# Altium project Scanner_Board.PrjPcb
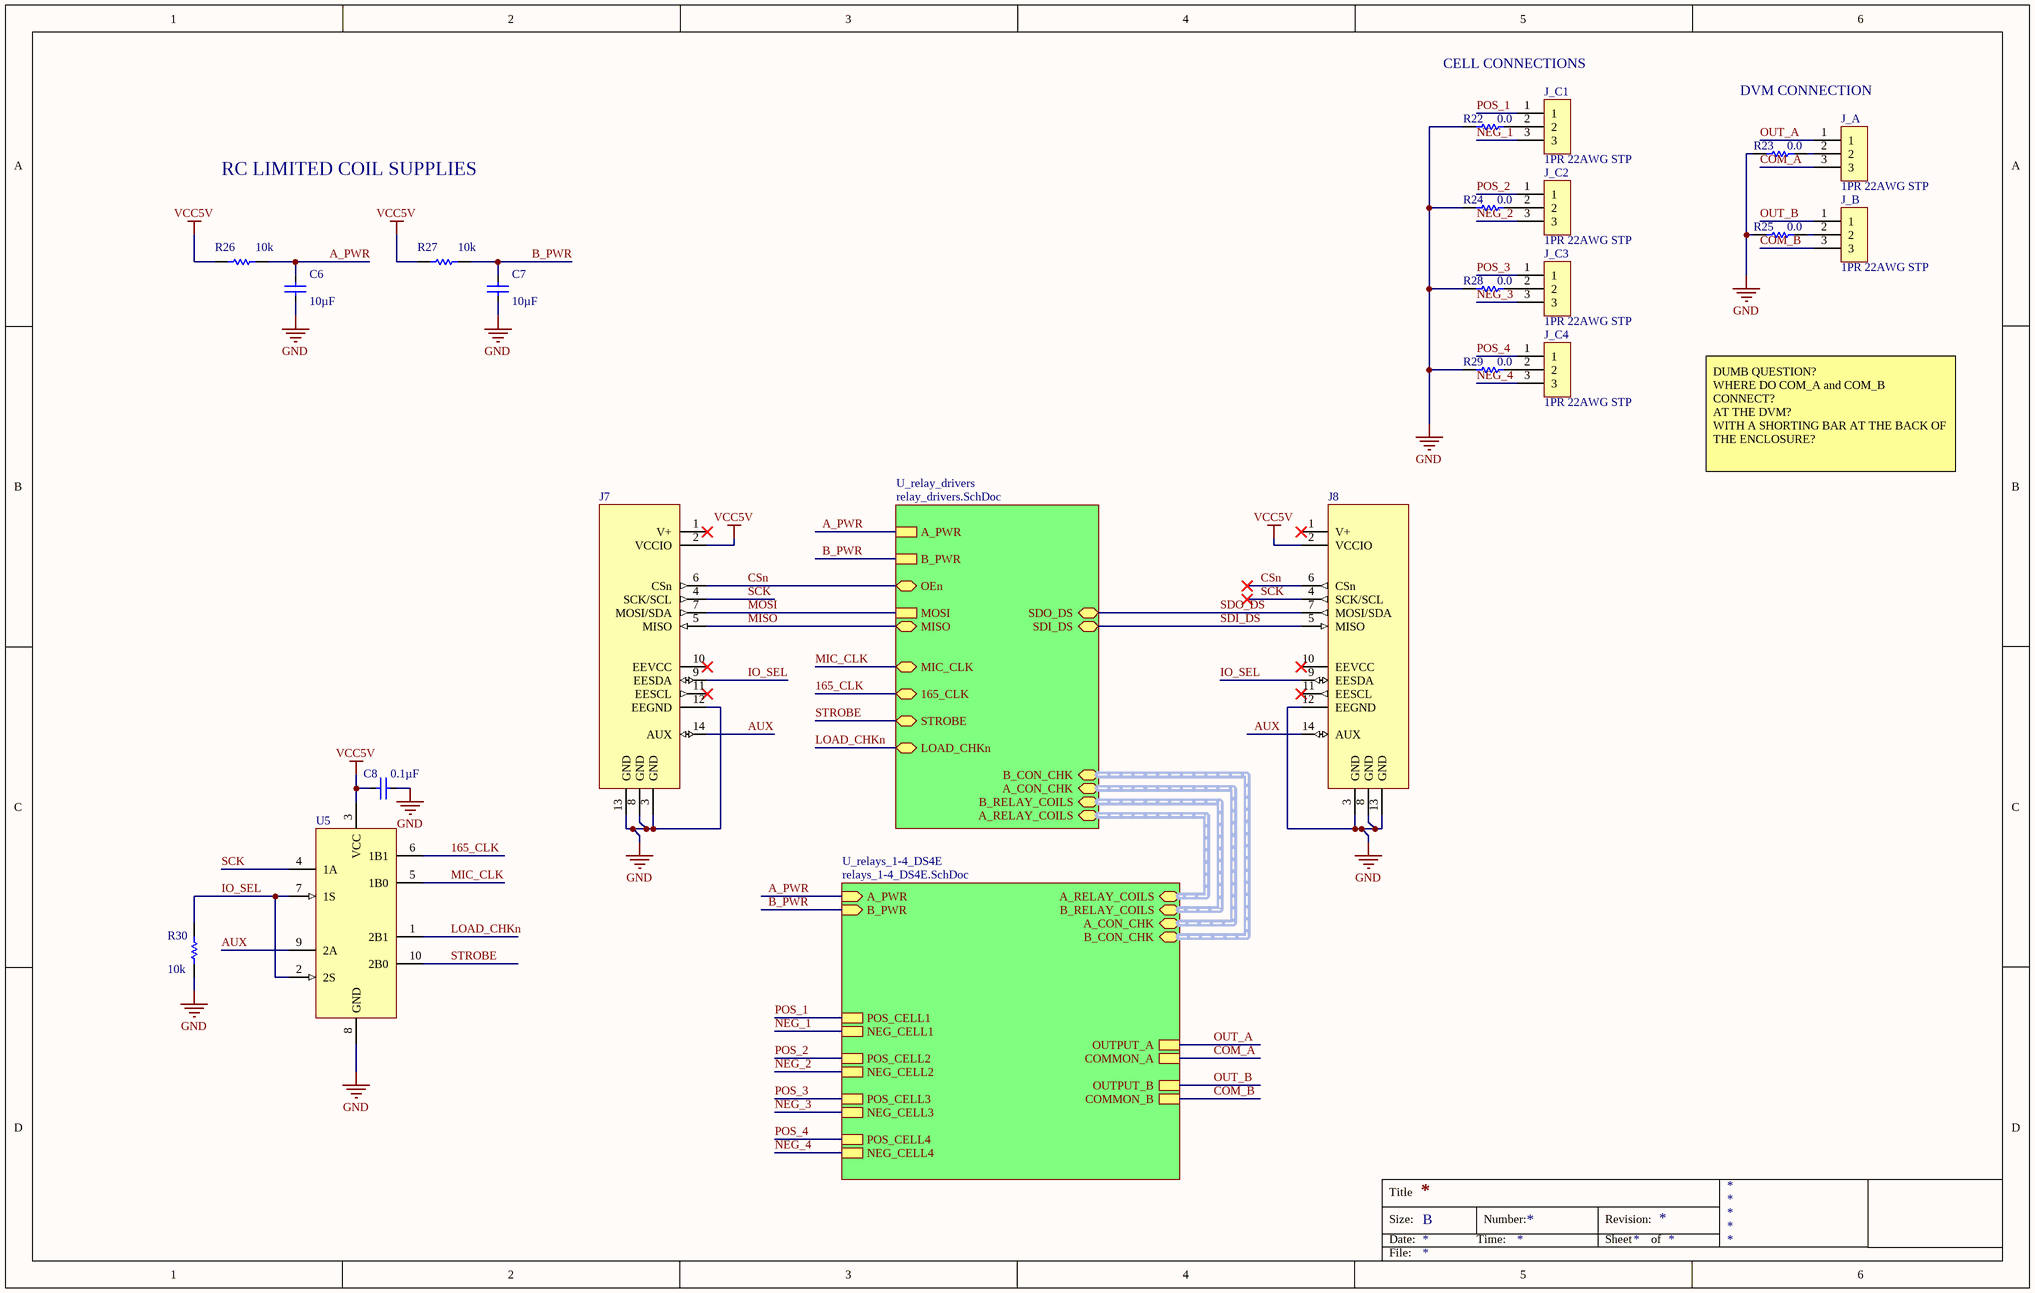
[diagram p0: scanner_board_TOP.SchDoc]
3 sheets, 74 parts. Net scope: hierarchical (ports join the sheet entries above them; power ports are global).
Board file: 4CH_Scanner_Board.PcbDoc
Sheets:
  scanner_board_TOP.SchDoc
    U_relays_1-4_DS4E = relays_1-4_DS4E.SchDoc
    U_relay_drivers = relay_drivers.SchDoc

## Sheet scanner_board_TOP.SchDoc
size B

### Parts
C6  10µF  [CAPC3216X160L55N]
C7  10µF  [CAPC3216X160L55N]
C8  0.1µF  [CAPC1005X55L25N]
J7  QUIKEVAL_HEADER  [0878311420]  (value not drawn)
J8  QUIKEVAL_HEADER  [0878311420]  (value not drawn)
J_A  1PR 22AWG STP  [HDRV3W25P100_3X1_300X100H500]
J_B  1PR 22AWG STP  [HDRV3W25P100_3X1_300X100H500]
J_C1  1PR 22AWG STP  [HDRV3W25P100_3X1_300X100H500]
J_C2  1PR 22AWG STP  [HDRV3W25P100_3X1_300X100H500]
J_C3  1PR 22AWG STP  [HDRV3W25P100_3X1_300X100H500]
J_C4  1PR 22AWG STP  [HDRV3W25P100_3X1_300X100H500]
R22  0.0  [RESC2012X75L55N]
R23  0.0  [RESC2012X75L55N]
R24  0.0  [RESC2012X75L55N]
R25  0.0  [RESC2012X75L55N]
R26  10k  [RESC_3216[1206]_N]
R27  10k  [RESC_3216[1206]_N]
R28  0.0  [RESC2012X75L55N]
R29  0.0  [RESC2012X75L55N]
R30  10k  [RESC2012X75L55N]
U5  FSA2257MUX  [SOP50P490X110-10L30N]  (value not drawn)

### Sub-sheets
U_relay_drivers = relay_drivers.SchDoc: A_PWR, B_PWR, MOSI, A_RELAY_COILS (harness 4CELL_CON_REL), B_RELAY_COILS (harness 4CELL_CON_REL), SDO_DS, MIC_CLK, A_CON_CHK (harness 4CELL_CON_CHK), B_CON_CHK (harness 4CELL_CON_CHK), MISO, STROBE, LOAD_CHKn, 165_CLK, SDI_DS, OEn
U_relays_1-4_DS4E = relays_1-4_DS4E.SchDoc: POS_CELL1, A_PWR (in), NEG_CELL1, B_PWR (in), POS_CELL2, NEG_CELL2, OUTPUT_A, COMMON_A, OUTPUT_B, COMMON_B, POS_CELL3, NEG_CELL3, POS_CELL4, NEG_CELL4, A_RELAY_COILS (harness 4CELL_CON_REL), B_RELAY_COILS (harness 4CELL_CON_REL), A_CON_CHK (harness 4CELL_CON_CHK), B_CON_CHK (harness 4CELL_CON_CHK)

### Nets
GND: C6.2 C7.2 C8.2 J7.3(GND) J7.8(GND) J7.12(EEGND) J7.13(GND) J8.3(GND) J8.8(GND) J8.12(EEGND) J8.13(GND) R22.2 R23.2 R24.2 R25.2 R28.2 R29.2 R30.1 U5.8(GND)
VCC5V: C8.1 J7.2(VCCIO) J8.2(VCCIO) R26.1 R27.1 U5.3(VCC)
165_CLK: U5.6(1B1) ; sheet U_relay_drivers/165_CLK
A_PWR: C6.1 R26.2 ; sheet U_relays_1-4_DS4E/A_PWR, sheet U_relay_drivers/A_PWR
AUX: J7.14(AUX) J8.14(AUX) U5.9(2A)
B_PWR: C7.1 R27.2 ; sheet U_relays_1-4_DS4E/B_PWR, sheet U_relay_drivers/B_PWR
COM_A: J_A.3 ; sheet U_relays_1-4_DS4E/COMMON_A
COM_B: J_B.3 ; sheet U_relays_1-4_DS4E/COMMON_B
CSn: J7.6(CSn) J8.6(CSn) ; sheet U_relay_drivers/OEn
IO_SEL: J7.9(EESDA) J8.9(EESDA) R30.2 U5.2(2S) U5.7(1S)
LOAD_CHKn: U5.1(2B1) ; sheet U_relay_drivers/LOAD_CHKn
MIC_CLK: U5.5(1B0) ; sheet U_relay_drivers/MIC_CLK
MISO: J7.5(MISO) ; sheet U_relay_drivers/MISO
MOSI: J7.7(MOSI/SDA) ; sheet U_relay_drivers/MOSI
NEG_1: J_C1.3 ; sheet U_relays_1-4_DS4E/NEG_CELL1
NEG_2: J_C2.3 ; sheet U_relays_1-4_DS4E/NEG_CELL2
NEG_3: J_C3.3 ; sheet U_relays_1-4_DS4E/NEG_CELL3
NEG_4: J_C4.3 ; sheet U_relays_1-4_DS4E/NEG_CELL4
OUT_A: J_A.1 ; sheet U_relays_1-4_DS4E/OUTPUT_A
OUT_B: J_B.1 ; sheet U_relays_1-4_DS4E/OUTPUT_B
POS_1: J_C1.1 ; sheet U_relays_1-4_DS4E/POS_CELL1
POS_2: J_C2.1 ; sheet U_relays_1-4_DS4E/POS_CELL2
POS_3: J_C3.1 ; sheet U_relays_1-4_DS4E/POS_CELL3
POS_4: J_C4.1 ; sheet U_relays_1-4_DS4E/POS_CELL4
SCK: J7.4(SCK/SCL) J8.4(SCK/SCL) U5.4(1A)
SDI_DS: J8.5(MISO) ; sheet U_relay_drivers/SDI_DS
SDO_DS: J8.7(MOSI/SDA) ; sheet U_relay_drivers/SDO_DS
STROBE: U5.10(2B0) ; sheet U_relay_drivers/STROBE
NetJ_A_2: J_A.2 R23.1
NetJ_B_2: J_B.2 R25.1
NetJ_C1_2: J_C1.2 R22.1
NetJ_C2_2: J_C2.2 R24.1
NetJ_C3_2: J_C3.2 R28.1
NetJ_C4_2: J_C4.2 R29.1

Not connected (* = marked no-connect by the designer): J7 1(V+)* 10(EEVCC)* 11(EESCL)*; J8 1(V+)* 10(EEVCC)* 11(EESCL)*

### Buses and harness runs
harness sheet U_relay_drivers/A_CON_CHK = sheet U_relays_1-4_DS4E/A_CON_CHK
harness sheet U_relay_drivers/A_RELAY_COILS = sheet U_relays_1-4_DS4E/A_RELAY_COILS
harness sheet U_relay_drivers/B_CON_CHK = sheet U_relays_1-4_DS4E/B_CON_CHK
harness sheet U_relay_drivers/B_RELAY_COILS = sheet U_relays_1-4_DS4E/B_RELAY_COILS

### Notes on the sheet
- CELL CONNECTIONS
- DVM CONNECTION
- RC LIMITED COIL SUPPLIES
- DUMB QUESTION?
  WHERE DO COM_A and COM_B CONNECT?
  AT THE DVM?
  WITH A SHORTING BAR AT THE BACK OF THE ENCLOSURE?
- Title
- Size:
- Date:
- B
- Time:
- Number:
- Revision:
- Sheet
- of
- File:

### Library data of the parts
C6 C7 = GRM31CR71E106KA12L: CAP CER 10UF 25V X7R 1206; Manufacturer: Murata Electronics North America; Tolerance: ±10%; Design Item Id: GRM31CR71E106KA12L; Supplier 1: Digi-Key; Supplier Part Number 1: 490-6518-1-ND; Manufacturer Part Number: GRM31CR71E106KA12L; RoHS: RoHS Compliant; Category: Capacitors; Stock 1: 157542; Pricing 1: 1=0.83, 10=0.706, 50=0.5194, 100=0.4129, 250=0.34632, 500=0.31302, 1000=0.28638 (USD); Packaging: Cut Tape (CT); Applications: General Purpose; Operating Temperature: -55°C ~ 125°C; Mounting Type: Surface Mount, MLCC; Package / Case: 1206 (3216 Metric); ComponentLink1URL: http://www.murata.com/~/media/webrenewal/support/library/catalog/products/capacitor/mlcc/c02e.pdf; ComponentLink1Description: http://www.murata.com/~/media/webrenewal/support/library/catalog/products/capacitor/mlcc/c02e.pdf; Capacitance: 10µF; Voltage - Rated: 25V; Temperature Coefficient: X7R; Ratings: -; Size / Dimension: 0.126" L x 0.063" W (3.20mm x 1.60mm); Height - Seated (Max): -; Thickness (Max): 0.071" (1.80mm); Lead Spacing: -; Features: -; Lead Style: -
C8 = GRM155R71C104JA88D: CAP CER 0.1UF 16V X7R 0402; Manufacturer: Murata Electronics North America; Tolerance: ±5%; Design Item Id: GRM155R71C104JA88D; Supplier 1: Digi-Key; Supplier Part Number 1: 490-6327-1-ND; Manufacturer Part Number: GRM155R71C104JA88D; RoHS: RoHS Compliant; Category: Capacitors; Stock 1: 844721; Pricing 1: 1=0.1, 10=0.026, 50=0.0144, 100=0.0121, 250=0.00992, 500=0.00848, 1000=0.0066, 5000=0.0055 (USD); Packaging: Cut Tape (CT); Applications: General Purpose; Operating Temperature: -55°C ~ 125°C; Mounting Type: Surface Mount, MLCC; Package / Case: 0402 (1005 Metric); ComponentLink1URL: http://www.murata.com/~/media/webrenewal/support/library/catalog/products/capacitor/mlcc/c02e.pdf; ComponentLink1Description: http://www.murata.com/~/media/webrenewal/support/library/catalog/products/capacitor/mlcc/c02e.pdf; Capacitance: 0.1µF; Voltage - Rated: 16V; Temperature Coefficient: X7R; Ratings: -; Size / Dimension: 0.039" L x 0.020" W (1.00mm x 0.50mm); Height - Seated (Max): -; Thickness (Max): 0.022" (0.55mm); Lead Spacing: -; Features: -; Lead Style: *
J7 J8 = 0878311420: CONN HEADER 14POS 2MM VERT GOLD; Manufacturer: Molex, LLC; Design Item Id: 0878311420; Supplier 1: Digi-Key; Supplier Part Number 1: WM17469-ND; Manufacturer Part Number: 0878311420; RoHS: RoHS Compliant; Category: Connectors, Interconnects; Stock 1: 20079; Pricing 1: 1=1.37, 10=1.239, 100=1.062, 500=0.88498, 1000=0.75855, 5000=0.67258, 10000=0.65741 (USD); Packaging: Tube
J_A J_B J_C1-J_C4 = CON-STP-22AWG-x3: SOLDER HOLES FOR 3 22AWG WIRES; Design Item Id: CON-STP-22AWG-x3
R22-R25 R28 R29 = ERJ-6BWFR030V: RES SMD 0.03 OHM 1% 1/2W 0805; Manufacturer: Panasonic Electronic Components; Resistance: 0.03; Power (Watts): 0.5W, 1/2W; Temperature Coefficient: ±200ppm/°C; Design Item Id: ERJ-6BWFR030V; Footprint: RESC_2012[0805]_N; Supplier 1: Digi-Key; Supplier Part Number 1: P.03AQCT-ND; Manufacturer Part Number: ERJ-6BWFR030V; RoHS: RoHS Compliant; Category: Resistors; Stock 1: 75764; Pricing 1: 1=0.66, 50=0.3466, 100=0.2859, 250=0.24832, 500=0.20212, 1000=0.16031 (USD); Packaging: Cut Tape (CT); Operating Temperature: -55°C ~ 155°C; Package / Case: 0805 (2012 Metric); Supplier Device Package: 0805; ComponentLink1URL: http://industrial.panasonic.com/lecs/www-data/pdf/AOA0000/AOA0000CE3.pdf; ComponentLink1Description: http://industrial.panasonic.com/lecs/www-data/pdf/AOA0000/AOA0000CE3.pdf; Tolerance: ±1%; Composition: Thick Film; Features: Automotive AEC-Q200, Current Sense; Size / Dimension: 0.079" L x 0.049" W (2.00mm x 1.25mm); Height: 0.028" (0.70mm); Number of Terminations: 2
R26 R27 = CRCW120610K0JNEA: RES SMD 10K OHM 5% 1/4W 1206; Manufacturer: Vishay Dale; Power (Watts): 0.25W, 1/4W; Temperature Coefficient: ±200ppm/°C; Resistance: 10k; Design Item Id: CRCW120610K0JNEA; Supplier 1: Digi-Key; Supplier Part Number 1: 541-10KECT-ND; Manufacturer Part Number: CRCW120610K0JNEA; RoHS: RoHS Compliant; Category: Resistors; Stock 1: 299066; Pricing 1: 10=0.04, 50=0.0214, 200=0.01235, 1000=0.00841 (USD); Packaging: Cut Tape (CT); Operating Temperature: -55°C ~ 155°C; Package / Case: 1206 (3216 Metric); Supplier Device Package: 1206 (3216 Metric); ComponentLink1URL: http://www.vishay.com/docs/20035/dcrcwe3.pdf; ComponentLink1Description: http://www.vishay.com/docs/20035/dcrcwe3.pdf; Tolerance: ±5%; Composition: Thick Film; Features: Automotive AEC-Q200; Size / Dimension: 0.126" L x 0.063" W (3.20mm x 1.60mm); Height: 0.024" (0.60mm); Number of Terminations: 2
R30 = ERJ-P06J103V: RES SMD 10K OHM 5% 1/2W 0805; Manufacturer: Panasonic Electronic Components; Power (Watts): 0.5W, 1/2W; Temperature Coefficient: ±200ppm/°C; Resistance: 10k; Design Item Id: ERJ-P06J103V; Supplier 1: Digi-Key; Supplier Part Number 1: P10KADCT-ND; Manufacturer Part Number: ERJ-P06J103V; RoHS: RoHS Compliant; Category: Resistors; Stock 1: 181490; Pricing 1: 1=0.12, 10=0.112, 100=0.0429, 1000=0.01889, 2500=0.01632 (USD); Packaging: Cut Tape (CT); Operating Temperature: -55°C ~ 155°C; Package / Case: 0805 (2012 Metric); Supplier Device Package: 0805; ComponentLink1URL: https://industrial.panasonic.com/cdbs/www-data/pdf/RDO0000/AOA0000C331.pdf; ComponentLink1Description: https://industrial.panasonic.com/cdbs/www-data/pdf/RDO0000/AOA0000C331.pdf; Tolerance: ±5%; Composition: Thick Film; Features: Automotive AEC-Q200, Pulse Withstanding; Size / Dimension: 0.079" L x 0.049" W (2.00mm x 1.25mm); Part Status: Active; Height - Seated (Max): 0.028" (0.70mm); Failure Rate: -
U5 = FSA2257MUX: IC SWITCH DUAL SPDT 10MSOP; Manufacturer: Fairchild/ON Semiconductor; Multiplexer/Demultiplexer Circuit: 2:1; On-State Resistance (Max): 1.5 Ohm (Typ); Design Item Id: FSA2257MUX; Supplier 1: Digi-Key; Supplier Part Number 1: FSA2257MUXCT-ND; Manufacturer Part Number: FSA2257MUX; RoHS: RoHS Compliant; Category: Integrated Circuits (ICs); Stock 1: 2927; Pricing 1: 1=0.85, 10=0.748, 100=0.5733, 500=0.4532, 1000=0.36256 (USD); Packaging: Cut Tape (CT); ComponentLink1URL: https://www.fairchildsemi.com/datasheets/FS/FSA2257.pdf; ComponentLink1Description: https://www.fairchildsemi.com/datasheets/FS/FSA2257.pdf; Part Status: Active; Switch Circuit: SPDT

## Sheet relays_1-4_DS4E.SchDoc
size B
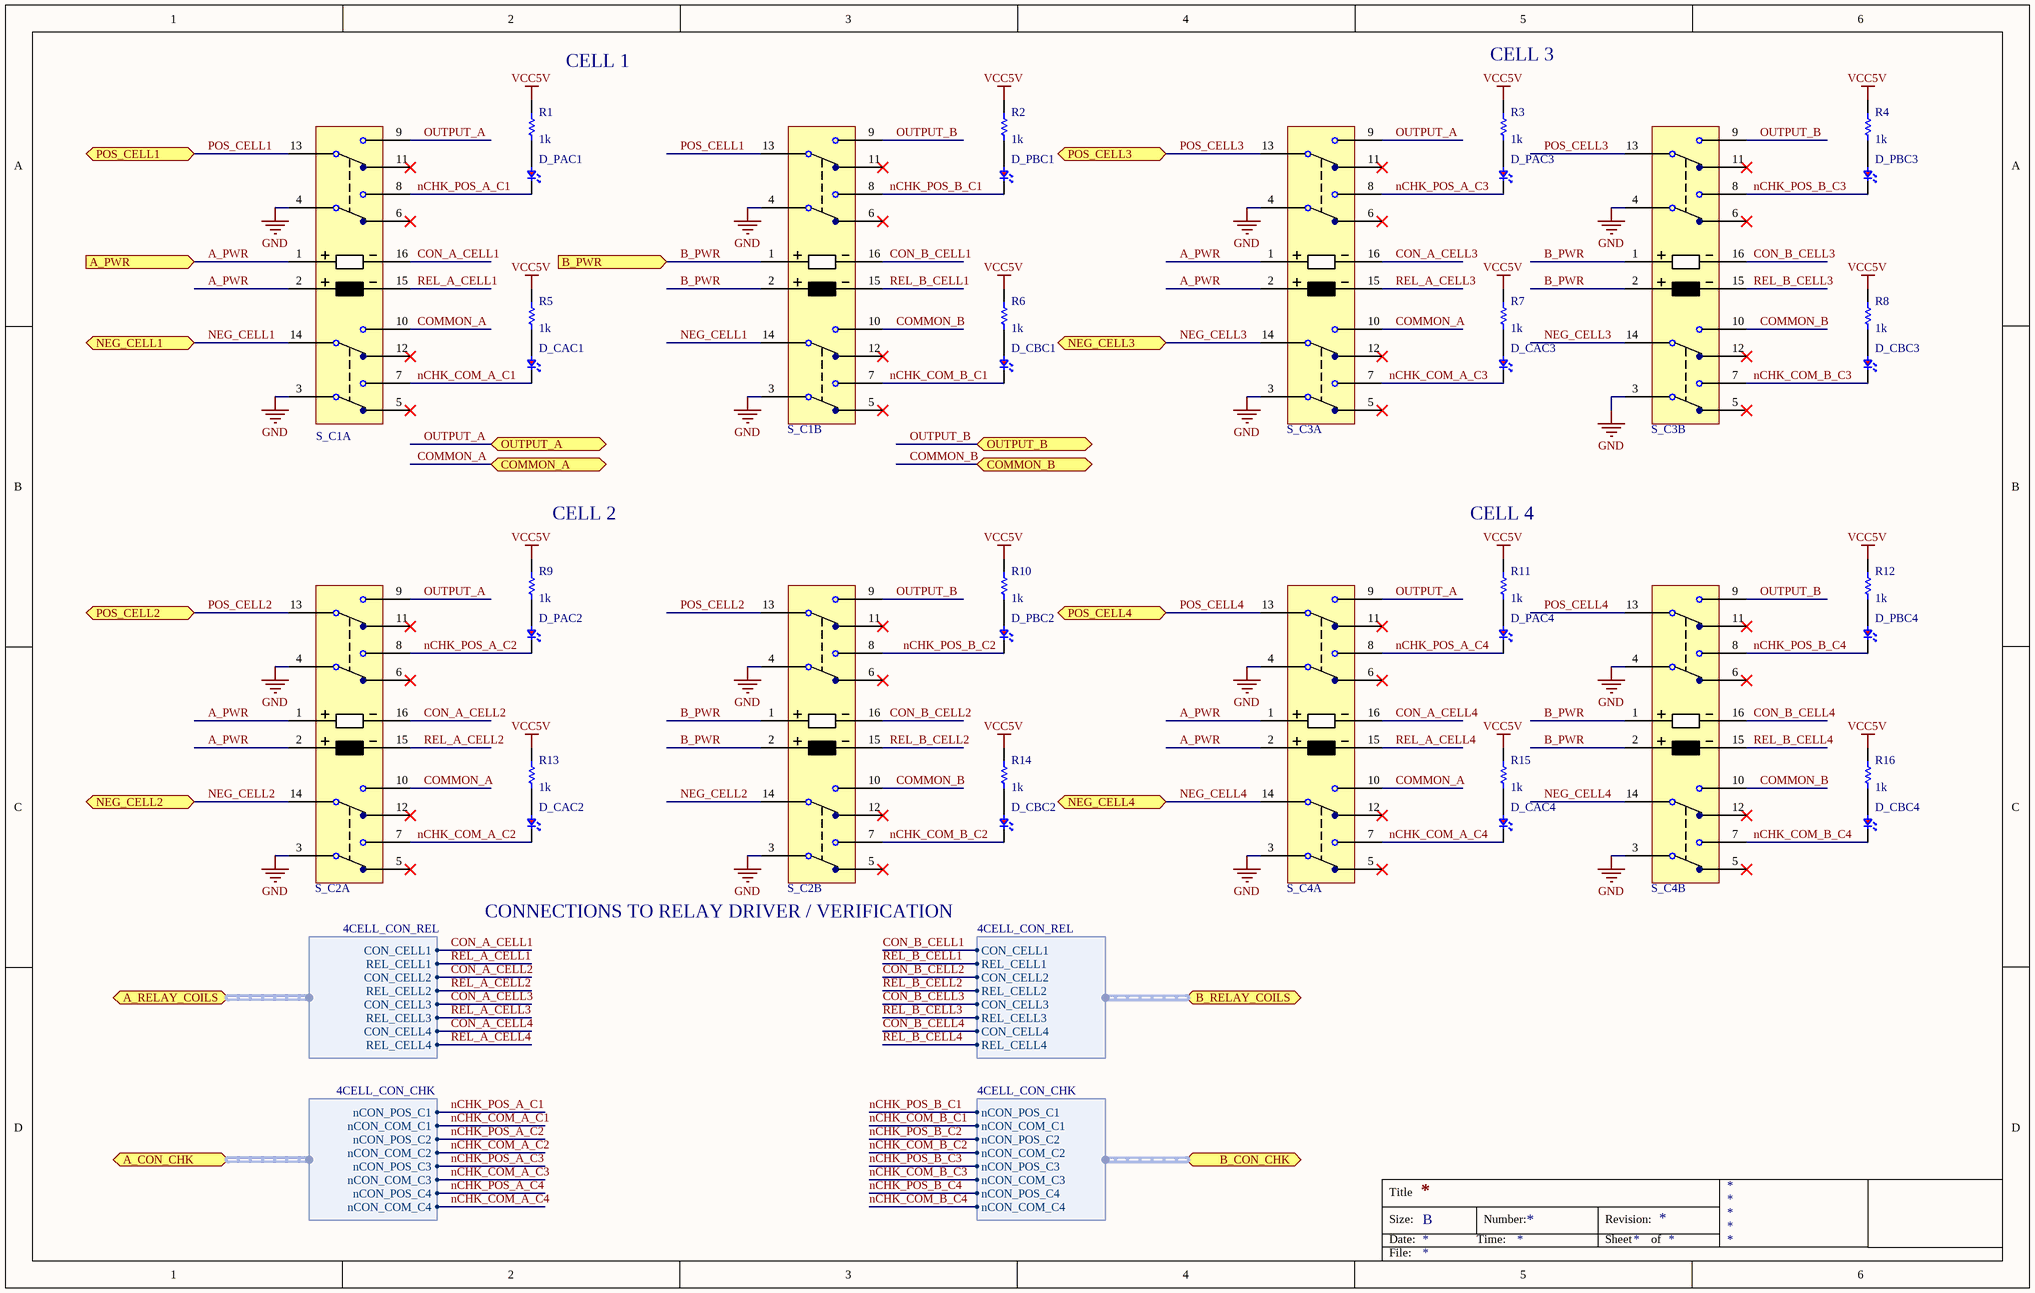
[diagram p1: relays_1-4_DS4E.SchDoc]

### Parts
D_CAC1  Red LED  [LEDRD100W25D118H196]  (value not drawn)
D_CAC2  Red LED  [LEDRD100W25D118H196]  (value not drawn)
D_CAC3  Red LED  [LEDRD100W25D118H196]  (value not drawn)
D_CAC4  Red LED  [LEDRD100W25D118H196]  (value not drawn)
D_CBC1  Red LED  [LEDRD100W25D118H196]  (value not drawn)
D_CBC2  Red LED  [LEDRD100W25D118H196]  (value not drawn)
D_CBC3  Red LED  [LEDRD100W25D118H196]  (value not drawn)
D_CBC4  Red LED  [LEDRD100W25D118H196]  (value not drawn)
D_PAC1  Red LED  [LEDRD100W25D118H196]  (value not drawn)
D_PAC2  Red LED  [LEDRD100W25D118H196]  (value not drawn)
D_PAC3  Red LED  [LEDRD100W25D118H196]  (value not drawn)
D_PAC4  Red LED  [LEDRD100W25D118H196]  (value not drawn)
D_PBC1  Red LED  [LEDRD100W25D118H196]  (value not drawn)
D_PBC2  Red LED  [LEDRD100W25D118H196]  (value not drawn)
D_PBC3  Red LED  [LEDRD100W25D118H196]  (value not drawn)
D_PBC4  Red LED  [LEDRD100W25D118H196]  (value not drawn)
R1  1k  [RESC2012X75L55N]
R2  1k  [RESC2012X75L55N]
R3  1k  [RESC2012X75L55N]
R4  1k  [RESC2012X75L55N]
R5  1k  [RESC2012X75L55N]
R6  1k  [RESC2012X75L55N]
R7  1k  [RESC2012X75L55N]
R8  1k  [RESC2012X75L55N]
R9  1k  [RESC2012X75L55N]
R10  1k  [RESC2012X75L55N]
R11  1k  [RESC2012X75L55N]
R12  1k  [RESC2012X75L55N]
R13  1k  [RESC2012X75L55N]
R14  1k  [RESC2012X75L55N]
R15  1k  [RESC2012X75L55N]
R16  1k  [RESC2012X75L55N]
S_C1A  4PDT_RELAY_L2  [L2_4PDT_RELAY]  (value not drawn)
S_C1B  4PDT_RELAY_L2  [L2_4PDT_RELAY]  (value not drawn)
S_C2A  4PDT_RELAY_L2  [L2_4PDT_RELAY]  (value not drawn)
S_C2B  4PDT_RELAY_L2  [L2_4PDT_RELAY]  (value not drawn)
S_C3A  4PDT_RELAY_L2  [L2_4PDT_RELAY]  (value not drawn)
S_C3B  4PDT_RELAY_L2  [L2_4PDT_RELAY]  (value not drawn)
S_C4A  4PDT_RELAY_L2  [L2_4PDT_RELAY]  (value not drawn)
S_C4B  4PDT_RELAY_L2  [L2_4PDT_RELAY]  (value not drawn)

### Ports
A_CON_CHK (harness 4CELL_CON_CHK), A_PWR (in), A_RELAY_COILS (harness 4CELL_CON_REL), B_CON_CHK (harness 4CELL_CON_CHK), B_PWR (in), B_RELAY_COILS (harness 4CELL_CON_REL), COMMON_A, COMMON_B, NEG_CELL1, NEG_CELL2, NEG_CELL3, NEG_CELL4, OUTPUT_A, OUTPUT_B, POS_CELL1, POS_CELL2, POS_CELL3, POS_CELL4

### Harnesses
4CELL_CON_REL: CON_CELL1, REL_CELL1, CON_CELL2, REL_CELL2, CON_CELL3, REL_CELL3, CON_CELL4, REL_CELL4
4CELL_CON_CHK: nCON_COM_C1, nCON_POS_C1, nCON_POS_C2, nCON_COM_C2, nCON_POS_C3, nCON_COM_C3, nCON_POS_C4, nCON_COM_C4

### Nets
GND: S_C1A.3 S_C1A.4 S_C1B.3 S_C1B.4 S_C2A.3 S_C2A.4 S_C2B.3 S_C2B.4 S_C3A.3 S_C3A.4 S_C3B.3 S_C3B.4 S_C4A.3 S_C4A.4 S_C4B.3 S_C4B.4
VCC5V: R1.2 R2.2 R3.2 R4.2 R5.2 R6.2 R7.2 R8.2 R9.2 R10.2 R11.2 R12.2 R13.2 R14.2 R15.2 R16.2
A_PWR: S_C1A.1 S_C1A.2 S_C2A.1 S_C2A.2 S_C3A.1 S_C3A.2 S_C4A.1 S_C4A.2 ; port A_PWR
B_PWR: S_C1B.1 S_C1B.2 S_C2B.1 S_C2B.2 S_C3B.1 S_C3B.2 S_C4B.1 S_C4B.2 ; port B_PWR
COMMON_A: S_C1A.10 S_C2A.10 S_C3A.10 S_C4A.10 ; port COMMON_A  [project net COM_A]
COMMON_B: S_C1B.10 S_C2B.10 S_C3B.10 S_C4B.10 ; port COMMON_B  [project net COM_B]
CON_A_CELL1: S_C1A.16 ; port A_RELAY_COILS.CON_CELL1
CON_A_CELL2: S_C2A.16 ; port A_RELAY_COILS.CON_CELL2
CON_A_CELL3: S_C3A.16 ; port A_RELAY_COILS.CON_CELL3
CON_A_CELL4: S_C4A.16 ; port A_RELAY_COILS.CON_CELL4
CON_B_CELL1: S_C1B.16 ; port B_RELAY_COILS.CON_CELL1
CON_B_CELL2: S_C2B.16 ; port B_RELAY_COILS.CON_CELL2
CON_B_CELL3: S_C3B.16 ; port B_RELAY_COILS.CON_CELL3
CON_B_CELL4: S_C4B.16 ; port B_RELAY_COILS.CON_CELL4
nCHK_COM_A_C1: D_CAC1.C S_C1A.7 ; port A_CON_CHK.nCON_COM_C1
nCHK_COM_A_C2: D_CAC2.C S_C2A.7 ; port A_CON_CHK.nCON_COM_C2
nCHK_COM_A_C3: D_CAC3.C S_C3A.7 ; port A_CON_CHK.nCON_COM_C3
nCHK_COM_A_C4: D_CAC4.C S_C4A.7 ; port A_CON_CHK.nCON_COM_C4
nCHK_COM_B_C1: D_CBC1.C S_C1B.7 ; port B_CON_CHK.nCON_COM_C1
nCHK_COM_B_C2: D_CBC2.C S_C2B.7 ; port B_CON_CHK.nCON_COM_C2
nCHK_COM_B_C3: D_CBC3.C S_C3B.7 ; port B_CON_CHK.nCON_COM_C3
nCHK_COM_B_C4: D_CBC4.C S_C4B.7 ; port B_CON_CHK.nCON_COM_C4
nCHK_POS_A_C1: D_PAC1.C S_C1A.8 ; port A_CON_CHK.nCON_POS_C1
nCHK_POS_A_C2: D_PAC2.C S_C2A.8 ; port A_CON_CHK.nCON_POS_C2
nCHK_POS_A_C3: D_PAC3.C S_C3A.8 ; port A_CON_CHK.nCON_POS_C3
nCHK_POS_A_C4: D_PAC4.C S_C4A.8 ; port A_CON_CHK.nCON_POS_C4
nCHK_POS_B_C1: D_PBC1.C S_C1B.8 ; port B_CON_CHK.nCON_POS_C1
nCHK_POS_B_C2: D_PBC2.C S_C2B.8 ; port B_CON_CHK.nCON_POS_C2
nCHK_POS_B_C3: D_PBC3.C S_C3B.8 ; port B_CON_CHK.nCON_POS_C3
nCHK_POS_B_C4: D_PBC4.C S_C4B.8 ; port B_CON_CHK.nCON_POS_C4
NEG_CELL1: S_C1A.14 S_C1B.14 ; port NEG_CELL1  [project net NEG_1]
NEG_CELL2: S_C2A.14 S_C2B.14 ; port NEG_CELL2  [project net NEG_2]
NEG_CELL3: S_C3A.14 S_C3B.14 ; port NEG_CELL3  [project net NEG_3]
NEG_CELL4: S_C4A.14 S_C4B.14 ; port NEG_CELL4  [project net NEG_4]
OUTPUT_A: S_C1A.9 S_C2A.9 S_C3A.9 S_C4A.9 ; port OUTPUT_A  [project net OUT_A]
OUTPUT_B: S_C1B.9 S_C2B.9 S_C3B.9 S_C4B.9 ; port OUTPUT_B  [project net OUT_B]
POS_CELL1: S_C1A.13 S_C1B.13 ; port POS_CELL1  [project net POS_1]
POS_CELL2: S_C2A.13 S_C2B.13 ; port POS_CELL2  [project net POS_2]
POS_CELL3: S_C3A.13 S_C3B.13 ; port POS_CELL3  [project net POS_3]
POS_CELL4: S_C4A.13 S_C4B.13 ; port POS_CELL4  [project net POS_4]
REL_A_CELL1: S_C1A.15 ; port A_RELAY_COILS.REL_CELL1
REL_A_CELL2: S_C2A.15 ; port A_RELAY_COILS.REL_CELL2
REL_A_CELL3: S_C3A.15 ; port A_RELAY_COILS.REL_CELL3
REL_A_CELL4: S_C4A.15 ; port A_RELAY_COILS.REL_CELL4
REL_B_CELL1: S_C1B.15 ; port B_RELAY_COILS.REL_CELL1
REL_B_CELL2: S_C2B.15 ; port B_RELAY_COILS.REL_CELL2
REL_B_CELL3: S_C3B.15 ; port B_RELAY_COILS.REL_CELL3
REL_B_CELL4: S_C4B.15 ; port B_RELAY_COILS.REL_CELL4
NetD_CAC1_A: D_CAC1.A R5.1
NetD_CAC2_A: D_CAC2.A R13.1
NetD_CAC3_A: D_CAC3.A R7.1
NetD_CAC4_A: D_CAC4.A R15.1
NetD_CBC1_A: D_CBC1.A R6.1
NetD_CBC2_A: D_CBC2.A R14.1
NetD_CBC3_A: D_CBC3.A R8.1
NetD_CBC4_A: D_CBC4.A R16.1
NetD_PAC1_A: D_PAC1.A R1.1
NetD_PAC2_A: D_PAC2.A R9.1
NetD_PAC3_A: D_PAC3.A R3.1
NetD_PAC4_A: D_PAC4.A R11.1
NetD_PBC1_A: D_PBC1.A R2.1
NetD_PBC2_A: D_PBC2.A R10.1
NetD_PBC3_A: D_PBC3.A R4.1
NetD_PBC4_A: D_PBC4.A R12.1

Not connected (* = marked no-connect by the designer): S_C1A 5* 6* 11* 12*; S_C1B 5* 6* 11* 12*; S_C2A 5* 6* 11* 12*; S_C2B 5* 6* 11* 12*; S_C3A 5* 6* 11* 12*; S_C3B 5* 6* 11* 12*; S_C4A 5* 6* 11* 12*; S_C4B 5* 6* 11* 12*

### Notes on the sheet
- (near R1) CELL 1
- (near R3) CELL 3
- (near R9) CELL 2
- (near R11) CELL 4
- (near S_C2B) CONNECTIONS TO RELAY DRIVER / VERIFICATION
- Title
- Size:
- Date:
- B
- Time:
- Number:
- Revision:
- Sheet
- of
- File:

### Library data of the parts
D_CAC1-D_CAC4 D_CBC1-D_CBC4 D_PAC1-D_PAC4 D_PBC1-D_PBC4 = SSI-LXH600ID-150: LED 5MM RED DIFF 6"LDS PANEL MT; Manufacturer: Lumex Opto/Components Inc.; Design Item Id: SSI-LXH600ID-150; Supplier 1: Digi-Key; Supplier Part Number 1: 67-1188-ND; Manufacturer Part Number: SSI-LXH600ID-150; RoHS: RoHS Compliant; Category: Optoelectronics; Stock 1: 4731; Pricing 1: 1=1.3, 10=1.06, 25=0.8152, 100=0.7335, 250=0.652, 500=0.5542, 1000=0.4564, 2500=0.43358, 5000=0.4238 (USD)
R1-R16 = ERJ-P06J102V: RES SMD 1K OHM 5% 1/2W 0805; Manufacturer: Panasonic Electronic Components; Resistance: 1k; Design Item Id: ERJ-P06J102V; Supplier 1: Digi-Key; Supplier Part Number 1: P1.0KADCT-ND; Manufacturer Part Number: ERJ-P06J102V; RoHS: RoHS Compliant; Category: Resistors; Stock 1: 1542; Pricing 1: 1=0.12, 10=0.112, 100=0.0429, 1000=0.01889, 2500=0.01632 (USD); Packaging: Cut Tape (CT)
S_C1A S_C1B S_C2A S_C2B S_C3A S_C3B S_C4A S_C4B = DS4E-ML2-DC5V: RELAY GENERAL PURPOSE 4PDT 2A 5V; Manufacturer: Panasonic Electric Works; Coil Type: Latching, Dual Coil; Coil Voltage: 5VDC; Contact Form: 4PDT (4 Form C); Switching Voltage: 250VAC, 220VDC - Max; Turn On Voltage (Max): 3.5 VDC; Coil Power: 360 mW; Design Item Id: DS4E-ML2-DC5V; Supplier 1: Digi-Key; Supplier Part Number 1: 255-1615-ND; Manufacturer Part Number: DS4E-ML2-DC5V; RoHS: RoHS Compliant; Category: Relays; Stock 1: 0; Pricing 1: 50=0 (USD); Packaging: Bulk; Features: Sealed - Amber; Operating Temperature: -40°C ~ 70°C; Mounting Type: Through Hole; ComponentLink1URL: http://media.digikey.com/pdf/Data%20Sheets/Panasonic%20Electric%20Works%20PDFs/DS_Series_July_2009.pdf; ComponentLink1Description: http://media.digikey.com/pdf/Data%20Sheets/Panasonic%20Electric%20Works%20PDFs/DS_Series_July_2009.pdf; Termination Style: PC Pin; Part Status: Obsolete; Relay Type: General Purpose; Turn Off Voltage (Min): -; Contact Material: Silver (Ag), Gold (Au)

## Sheet relay_drivers.SchDoc
size B
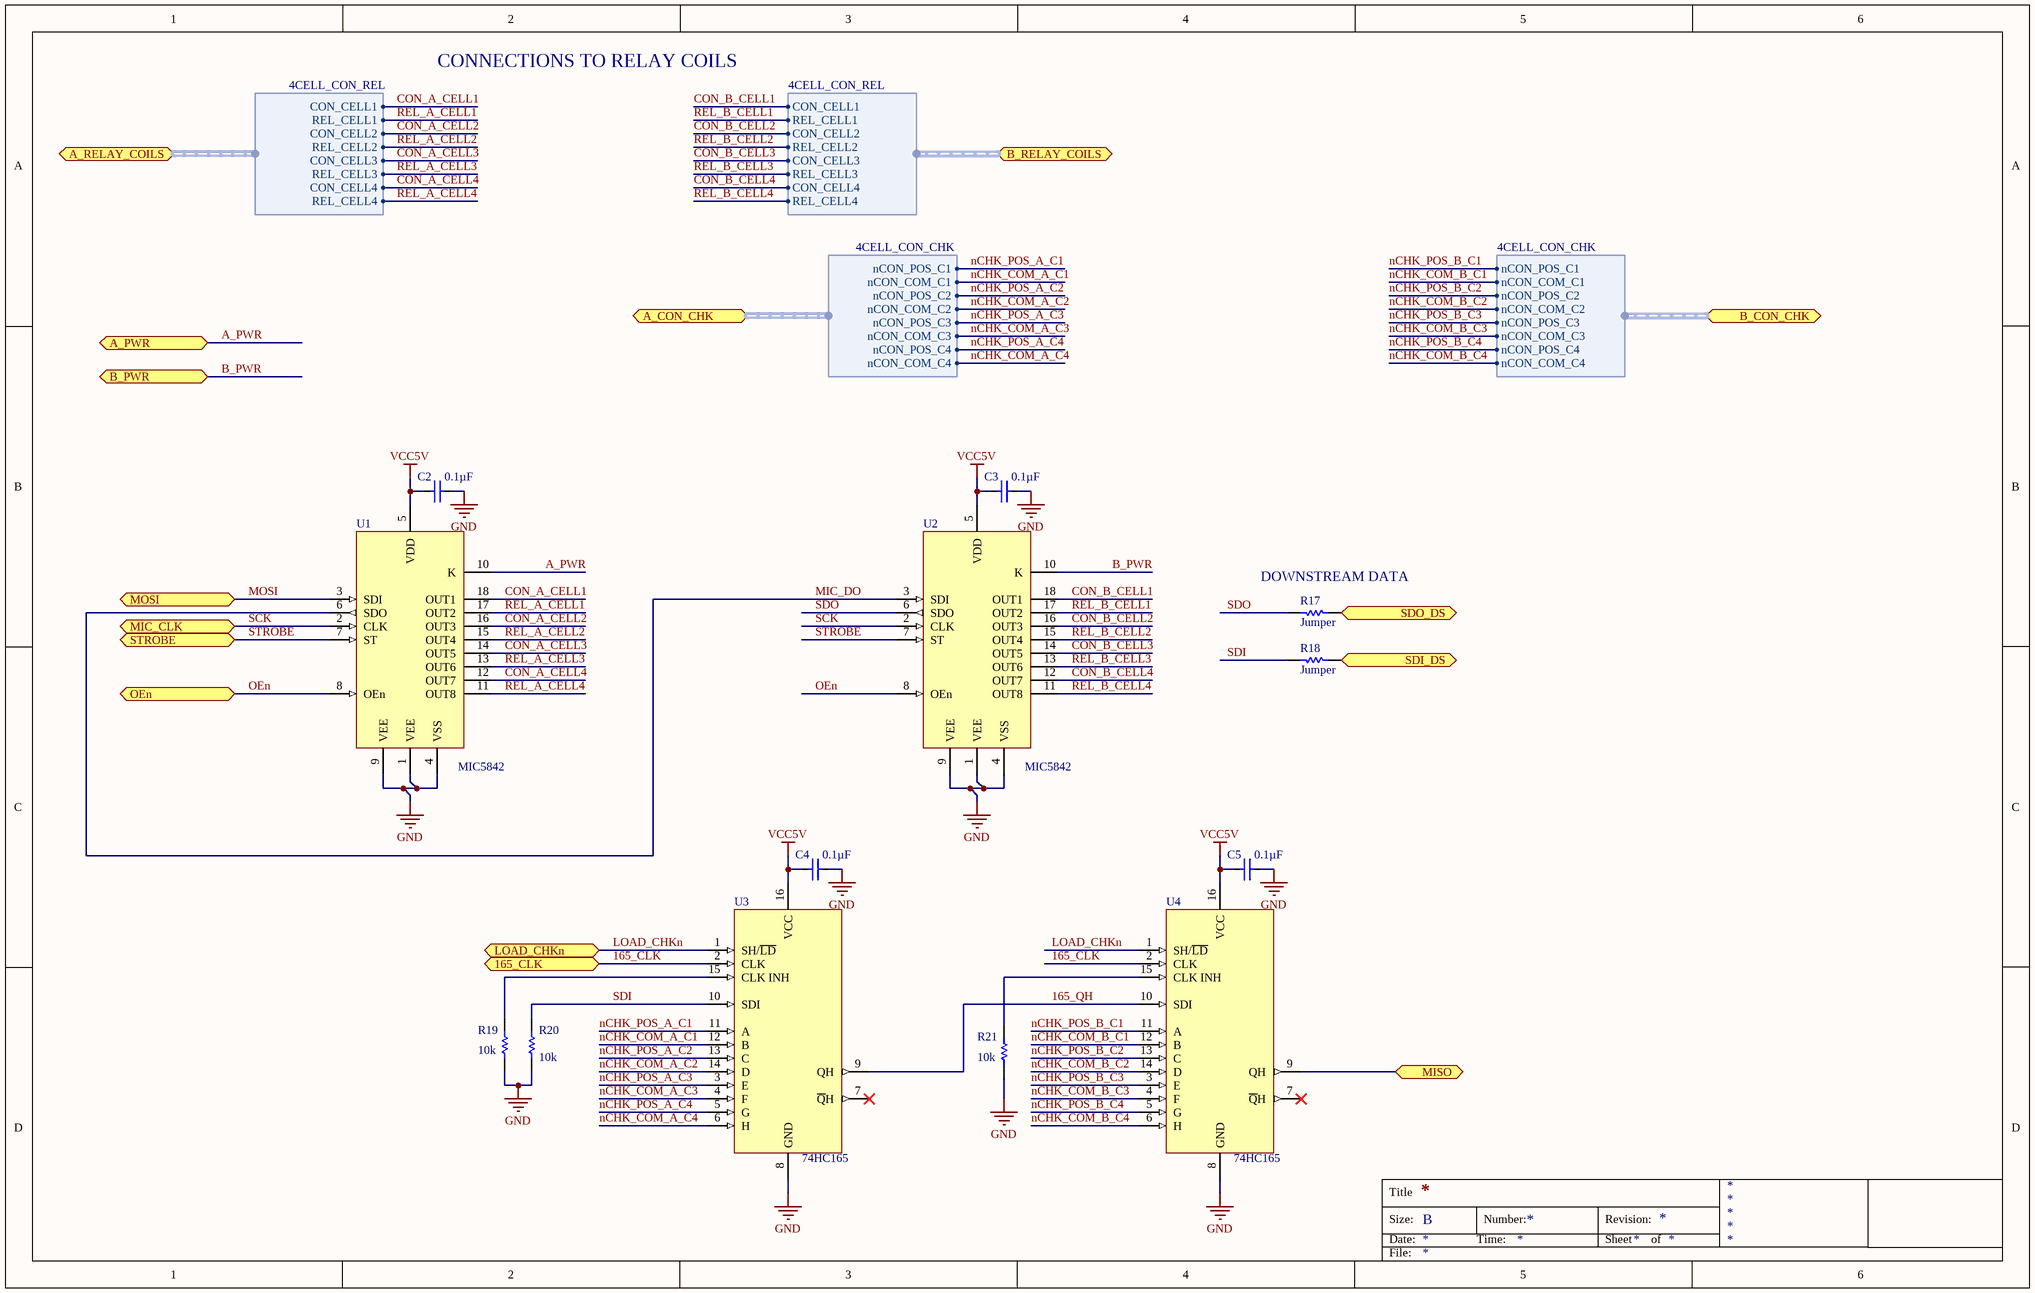
[diagram p2: relay_drivers.SchDoc]

### Parts
C2  0.1µF  [CAPC1005X55L25N]
C3  0.1µF  [CAPC1005X55L25N]
C4  0.1µF  [CAPC1005X55L25N]
C5  0.1µF  [CAPC1005X55L25N]
R17  Jumper  [RESC_2012[0805]_N]
R18  Jumper  [RESC_2012[0805]_N]
R19  10k  [RESC2012X75L55N]
R20  10k  [RESC2012X75L55N]
R21  10k  [RESC2012X75L55N]
U1  MIC5842  [SOIC18P127_1155X1030X265L83X41N]
U2  MIC5842  [SOIC18P127_1155X1030X265L83X41N]
U3  74HC165  [SOIC16P127_990X600X175L83X41N]
U4  74HC165  [SOIC16P127_990X600X175L83X41N]

### Ports
165_CLK, A_CON_CHK (harness 4CELL_CON_CHK), A_PWR, A_RELAY_COILS (harness 4CELL_CON_REL), B_CON_CHK (harness 4CELL_CON_CHK), B_PWR, B_RELAY_COILS (harness 4CELL_CON_REL), LOAD_CHKn, MIC_CLK, MISO, MOSI, OEn, SDI_DS, SDO_DS, STROBE

### Harnesses
4CELL_CON_REL: CON_CELL1, REL_CELL1, CON_CELL2, REL_CELL2, CON_CELL3, REL_CELL3, CON_CELL4, REL_CELL4
4CELL_CON_CHK: nCON_COM_C1, nCON_POS_C1, nCON_POS_C2, nCON_COM_C2, nCON_POS_C3, nCON_COM_C3, nCON_POS_C4, nCON_COM_C4

### Nets
GND: C2.2 C3.2 C4.2 C5.2 R19.1 R20.1 R21.1 U1.1(VEE) U1.4(VSS) U1.9(VEE) U2.1(VEE) U2.4(VSS) U2.9(VEE) U3.8(GND) U4.8(GND)
VCC5V: C2.1 C3.1 C4.1 C5.1 U1.5(VDD) U2.5(VDD) U3.16(VCC) U4.16(VCC)
165_CLK: U3.2(CLK) U4.2(CLK) ; port 165_CLK
165_QH: U3.9(QH) U4.10(SDI)
A_PWR: U1.10(K) ; port A_PWR
B_PWR: U2.10(K) ; port B_PWR
CON_A_CELL1: U1.18(OUT1) ; port A_RELAY_COILS.CON_CELL1
CON_A_CELL2: U1.16(OUT3) ; port A_RELAY_COILS.CON_CELL2
CON_A_CELL3: U1.14(OUT5) ; port A_RELAY_COILS.CON_CELL3
CON_A_CELL4: U1.12(OUT7) ; port A_RELAY_COILS.CON_CELL4
CON_B_CELL1: U2.18(OUT1) ; port B_RELAY_COILS.CON_CELL1
CON_B_CELL2: U2.16(OUT3) ; port B_RELAY_COILS.CON_CELL2
CON_B_CELL3: U2.14(OUT5) ; port B_RELAY_COILS.CON_CELL3
CON_B_CELL4: U2.12(OUT7) ; port B_RELAY_COILS.CON_CELL4
LOAD_CHKn: U3.1(SH/~{LD}) U4.1(SH/~{LD}) ; port LOAD_CHKn
MIC_DO: U1.6(SDO) U2.3(SDI)
MISO: U4.9(QH) ; port MISO
MOSI: U1.3(SDI) ; port MOSI
nCHK_COM_A_C1: U3.12(B) ; port A_CON_CHK.nCON_COM_C1
nCHK_COM_A_C2: U3.14(D) ; port A_CON_CHK.nCON_COM_C2
nCHK_COM_A_C3: U3.4(F) ; port A_CON_CHK.nCON_COM_C3
nCHK_COM_A_C4: U3.6(H) ; port A_CON_CHK.nCON_COM_C4
nCHK_COM_B_C1: U4.12(B) ; port B_CON_CHK.nCON_COM_C1
nCHK_COM_B_C2: U4.14(D) ; port B_CON_CHK.nCON_COM_C2
nCHK_COM_B_C3: U4.4(F) ; port B_CON_CHK.nCON_COM_C3
nCHK_COM_B_C4: U4.6(H) ; port B_CON_CHK.nCON_COM_C4
nCHK_POS_A_C1: U3.11(A) ; port A_CON_CHK.nCON_POS_C1
nCHK_POS_A_C2: U3.13(C) ; port A_CON_CHK.nCON_POS_C2
nCHK_POS_A_C3: U3.3(E) ; port A_CON_CHK.nCON_POS_C3
nCHK_POS_A_C4: U3.5(G) ; port A_CON_CHK.nCON_POS_C4
nCHK_POS_B_C1: U4.11(A) ; port B_CON_CHK.nCON_POS_C1
nCHK_POS_B_C2: U4.13(C) ; port B_CON_CHK.nCON_POS_C2
nCHK_POS_B_C3: U4.3(E) ; port B_CON_CHK.nCON_POS_C3
nCHK_POS_B_C4: U4.5(G) ; port B_CON_CHK.nCON_POS_C4
OEn: U1.8(OEn) U2.8(OEn) ; port OEn  [project net CSn]
REL_A_CELL1: U1.17(OUT2) ; port A_RELAY_COILS.REL_CELL1
REL_A_CELL2: U1.15(OUT4) ; port A_RELAY_COILS.REL_CELL2
REL_A_CELL3: U1.13(OUT6) ; port A_RELAY_COILS.REL_CELL3
REL_A_CELL4: U1.11(OUT8) ; port A_RELAY_COILS.REL_CELL4
REL_B_CELL1: U2.17(OUT2) ; port B_RELAY_COILS.REL_CELL1
REL_B_CELL2: U2.15(OUT4) ; port B_RELAY_COILS.REL_CELL2
REL_B_CELL3: U2.13(OUT6) ; port B_RELAY_COILS.REL_CELL3
REL_B_CELL4: U2.11(OUT8) ; port B_RELAY_COILS.REL_CELL4
SCK: U1.2(CLK) U2.2(CLK) ; port MIC_CLK  [project net MIC_CLK]
SDI: R18.2 R20.2 U3.10(SDI)
SDI_DS: R18.1 ; port SDI_DS
SDO: R17.2 U2.6(SDO)
SDO_DS: R17.1 ; port SDO_DS
STROBE: U1.7(ST) U2.7(ST) ; port STROBE
NetR19_2: R19.2 U3.15(CLK_INH)
NetR21_2: R21.2 U4.15(CLK_INH)

Not connected (* = marked no-connect by the designer): U3 7(~{Q}H)*; U4 7(~{Q}H)*

### Notes on the sheet
- CONNECTIONS TO RELAY COILS
- (near R17) DOWNSTREAM DATA
- Title
- Size:
- Date:
- B
- Time:
- Number:
- Revision:
- Sheet
- of
- File:

### Library data of the parts
C2-C5 = GRM155R71C104JA88D: as C8 on sheet scanner_board_TOP; Design Item Id: GRM155R71C104JA88D; Supplier 1: Digi-Key; Supplier Part Number 1: 490-6327-1-ND; Manufacturer Part Number: GRM155R71C104JA88D; RoHS: RoHS Compliant; Category: Capacitors; Stock 1: 844721; Pricing 1: 1=0.1, 10=0.026, 50=0.0144, 100=0.0121, 250=0.00992, 500=0.00848, 1000=0.0066, 5000=0.0055 (USD); Packaging: Cut Tape (CT); Applications: General Purpose; Operating Temperature: -55°C ~ 125°C; Mounting Type: Surface Mount, MLCC; Package / Case: 0402 (1005 Metric); ComponentLink1URL: http://www.murata.com/~/media/webrenewal/support/library/catalog/products/capacitor/mlcc/c02e.pdf; ComponentLink1Description: http://www.murata.com/~/media/webrenewal/support/library/catalog/products/capacitor/mlcc/c02e.pdf; Capacitance: 0.1µF; Voltage - Rated: 16V; Temperature Coefficient: X7R; Ratings: -; Size / Dimension: 0.039" L x 0.020" W (1.00mm x 0.50mm); Height - Seated (Max): -; Thickness (Max): 0.022" (0.55mm); Lead Spacing: -; Features: -; Lead Style: *
R17 R18 = WSL0805R0500FEA18: RES SMD 0.05 OHM 1% 1/4W 0805; Manufacturer: Vishay Dale; Resistance: 0.05; Power (Watts): 0.25W, 1/4W; Temperature Coefficient: ±75ppm/°C; Design Item Id: WSL0805R0500FEA18; Supplier 1: Digi-Key; Supplier Part Number 1: WSLB-.05CT-ND; Manufacturer Part Number: WSL0805R0500FEA18; RoHS: RoHS Compliant; Category: Resistors; Stock 1: 6290; Pricing 1: 1=1, 10=0.887, 25=0.8152, 50=0.7436, 100=0.6435, 250=0.5434, 500=0.4576, 1000=0.38038, 2500=0.3718 (USD); Packaging: Cut Tape (CT); Operating Temperature: -65°C ~ 170°C; Package / Case: 0805 (2012 Metric); Supplier Device Package: 0805; ComponentLink1URL: http://www.vishay.com/docs/31057/wslhigh.pdf; ComponentLink1Description: http://www.vishay.com/docs/31057/wslhigh.pdf; Tolerance: ±1%; Composition: Metal Element; Features: Current Sense, Moisture Resistant, Pulse Withstanding; Size / Dimension: 0.080" L x 0.050" W (2.03mm x 1.27mm); Height: 0.018" (0.46mm); Number of Terminations: 2
R19-R21 = ERJ-P06J103V: as R30 on sheet scanner_board_TOP; Resistance: 10k; Design Item Id: ERJ-P06J103V; Supplier 1: Digi-Key; Supplier Part Number 1: P10KADCT-ND; Manufacturer Part Number: ERJ-P06J103V; RoHS: RoHS Compliant; Category: Resistors; Stock 1: 181490; Pricing 1: 1=0.12, 10=0.112, 100=0.0429, 1000=0.01889, 2500=0.01632 (USD); Packaging: Cut Tape (CT); Operating Temperature: -55°C ~ 155°C; Package / Case: 0805 (2012 Metric); Supplier Device Package: 0805; ComponentLink1URL: https://industrial.panasonic.com/cdbs/www-data/pdf/RDO0000/AOA0000C331.pdf; ComponentLink1Description: https://industrial.panasonic.com/cdbs/www-data/pdf/RDO0000/AOA0000C331.pdf; Tolerance: ±5%; Composition: Thick Film; Features: Automotive AEC-Q200, Pulse Withstanding; Size / Dimension: 0.079" L x 0.049" W (2.00mm x 1.25mm); Part Status: Active; Height - Seated (Max): 0.028" (0.70mm); Failure Rate: -
U1 U2 = MIC5842YWM: IC DRVR LATCH 8BIT SER IN 18SOIC; Manufacturer: Microchip Technology; Current - Output (Max): 500mA; Switch Type: Latched Driver; Number of Outputs: 8; Output Configuration: Low Side; Output Type: Bipolar; Interface: Strobe, Serial; Voltage - Load: 15V (Max); Input Type: Non-Inverting; Design Item Id: MIC5842YWM; Supplier 1: Digi-Key; Supplier Part Number 1: 576-2402-ND; Manufacturer Part Number: MIC5842YWM; RoHS: RoHS Compliant; Category: Integrated Circuits (ICs); Stock 1: 306; Pricing 1: 1=2.91, 25=2.4256, 100=2.205 (USD); Packaging: Tube; Features: -; Operating Temperature: -55°C ~ 85°C (TA); Package / Case: 18-SOIC (0.295", 7.50mm Width); Supplier Device Package: 18-SOP (Wide); ComponentLink1URL: http://www.microchip.com/mymicrochip/filehandler.aspx?ddocname=en580483; ComponentLink1Description: http://www.microchip.com/mymicrochip/filehandler.aspx?ddocname=en580483; Part Status: Active; Voltage - Supply (Vcc/Vdd): -; Rds On (Typ): -; Fault Protection: -
U3 U4 = 74HC165D: IC 8BIT SHIFT REGISTER 16SOIC; Manufacturer: Toshiba Semiconductor and Storage; Function: Parallel or Serial to Serial; Output Type: Complementary; Voltage - Supply: 2 V ~ 6 V; Design Item Id: 74HC165D; Supplier 1: Digi-Key; Supplier Part Number 1: 74HC165DCT-ND; Manufacturer Part Number: 74HC165D; RoHS: RoHS Compliant; Category: Integrated Circuits (ICs); Stock 1: 4480; Pricing 1: 1=0.41, 10=0.32, 25=0.27, 100=0.2199, 250=0.1822, 500=0.1508, 1000=0.11309 (USD); Packaging: Cut Tape (CT); Operating Temperature: -40°C ~ 85°C; Mounting Type: Surface Mount; Package / Case: 16-SOIC (0.154", 3.90mm Width); Supplier Device Package: 16-SOIC; ComponentLink1URL: https://toshiba.semicon-storage.com/info/docget.jsp?did=37227&prodName=74HC165D; ComponentLink1Description: https://toshiba.semicon-storage.com/info/docget.jsp?did=37227&prodName=74HC165D; Logic Type: Shift Register; Part Status: Active

## Nets that join several sheets
GND: scanner_board_TOP (19 pins), relays_1-4_DS4E (16 pins), relay_drivers (15 pins)
VCC5V: scanner_board_TOP (6 pins), relays_1-4_DS4E (16 pins), relay_drivers (8 pins)
165_CLK: scanner_board_TOP (U5.6), relay_drivers (U3.2 U4.2)
A_PWR: scanner_board_TOP (C6.1 R26.2), relays_1-4_DS4E (8 pins), relay_drivers (U1.10)
B_PWR: scanner_board_TOP (C7.1 R27.2), relays_1-4_DS4E (8 pins), relay_drivers (U2.10)
COM_A: scanner_board_TOP (J_A.3), relays_1-4_DS4E (S_C1A.10 S_C2A.10 S_C3A.10 S_C4A.10)
COM_B: scanner_board_TOP (J_B.3), relays_1-4_DS4E (S_C1B.10 S_C2B.10 S_C3B.10 S_C4B.10)
CON_A_CELL1: relays_1-4_DS4E (S_C1A.16), relay_drivers (U1.18)
CON_A_CELL2: relays_1-4_DS4E (S_C2A.16), relay_drivers (U1.16)
CON_A_CELL3: relays_1-4_DS4E (S_C3A.16), relay_drivers (U1.14)
CON_A_CELL4: relays_1-4_DS4E (S_C4A.16), relay_drivers (U1.12)
CON_B_CELL1: relays_1-4_DS4E (S_C1B.16), relay_drivers (U2.18)
CON_B_CELL2: relays_1-4_DS4E (S_C2B.16), relay_drivers (U2.16)
CON_B_CELL3: relays_1-4_DS4E (S_C3B.16), relay_drivers (U2.14)
CON_B_CELL4: relays_1-4_DS4E (S_C4B.16), relay_drivers (U2.12)
CSn: scanner_board_TOP (J7.6 J8.6), relay_drivers (U1.8 U2.8)
LOAD_CHKn: scanner_board_TOP (U5.1), relay_drivers (U3.1 U4.1)
MIC_CLK: scanner_board_TOP (U5.5), relay_drivers (U1.2 U2.2)
MISO: scanner_board_TOP (J7.5), relay_drivers (U4.9)
MOSI: scanner_board_TOP (J7.7), relay_drivers (U1.3)
nCHK_COM_A_C1: relays_1-4_DS4E (D_CAC1.C S_C1A.7), relay_drivers (U3.12)
nCHK_COM_A_C2: relays_1-4_DS4E (D_CAC2.C S_C2A.7), relay_drivers (U3.14)
nCHK_COM_A_C3: relays_1-4_DS4E (D_CAC3.C S_C3A.7), relay_drivers (U3.4)
nCHK_COM_A_C4: relays_1-4_DS4E (D_CAC4.C S_C4A.7), relay_drivers (U3.6)
nCHK_COM_B_C1: relays_1-4_DS4E (D_CBC1.C S_C1B.7), relay_drivers (U4.12)
nCHK_COM_B_C2: relays_1-4_DS4E (D_CBC2.C S_C2B.7), relay_drivers (U4.14)
nCHK_COM_B_C3: relays_1-4_DS4E (D_CBC3.C S_C3B.7), relay_drivers (U4.4)
nCHK_COM_B_C4: relays_1-4_DS4E (D_CBC4.C S_C4B.7), relay_drivers (U4.6)
nCHK_POS_A_C1: relays_1-4_DS4E (D_PAC1.C S_C1A.8), relay_drivers (U3.11)
nCHK_POS_A_C2: relays_1-4_DS4E (D_PAC2.C S_C2A.8), relay_drivers (U3.13)
nCHK_POS_A_C3: relays_1-4_DS4E (D_PAC3.C S_C3A.8), relay_drivers (U3.3)
nCHK_POS_A_C4: relays_1-4_DS4E (D_PAC4.C S_C4A.8), relay_drivers (U3.5)
nCHK_POS_B_C1: relays_1-4_DS4E (D_PBC1.C S_C1B.8), relay_drivers (U4.11)
nCHK_POS_B_C2: relays_1-4_DS4E (D_PBC2.C S_C2B.8), relay_drivers (U4.13)
nCHK_POS_B_C3: relays_1-4_DS4E (D_PBC3.C S_C3B.8), relay_drivers (U4.3)
nCHK_POS_B_C4: relays_1-4_DS4E (D_PBC4.C S_C4B.8), relay_drivers (U4.5)
NEG_1: scanner_board_TOP (J_C1.3), relays_1-4_DS4E (S_C1A.14 S_C1B.14)
NEG_2: scanner_board_TOP (J_C2.3), relays_1-4_DS4E (S_C2A.14 S_C2B.14)
NEG_3: scanner_board_TOP (J_C3.3), relays_1-4_DS4E (S_C3A.14 S_C3B.14)
NEG_4: scanner_board_TOP (J_C4.3), relays_1-4_DS4E (S_C4A.14 S_C4B.14)
OUT_A: scanner_board_TOP (J_A.1), relays_1-4_DS4E (S_C1A.9 S_C2A.9 S_C3A.9 S_C4A.9)
OUT_B: scanner_board_TOP (J_B.1), relays_1-4_DS4E (S_C1B.9 S_C2B.9 S_C3B.9 S_C4B.9)
POS_1: scanner_board_TOP (J_C1.1), relays_1-4_DS4E (S_C1A.13 S_C1B.13)
POS_2: scanner_board_TOP (J_C2.1), relays_1-4_DS4E (S_C2A.13 S_C2B.13)
POS_3: scanner_board_TOP (J_C3.1), relays_1-4_DS4E (S_C3A.13 S_C3B.13)
POS_4: scanner_board_TOP (J_C4.1), relays_1-4_DS4E (S_C4A.13 S_C4B.13)
REL_A_CELL1: relays_1-4_DS4E (S_C1A.15), relay_drivers (U1.17)
REL_A_CELL2: relays_1-4_DS4E (S_C2A.15), relay_drivers (U1.15)
REL_A_CELL3: relays_1-4_DS4E (S_C3A.15), relay_drivers (U1.13)
REL_A_CELL4: relays_1-4_DS4E (S_C4A.15), relay_drivers (U1.11)
REL_B_CELL1: relays_1-4_DS4E (S_C1B.15), relay_drivers (U2.17)
REL_B_CELL2: relays_1-4_DS4E (S_C2B.15), relay_drivers (U2.15)
REL_B_CELL3: relays_1-4_DS4E (S_C3B.15), relay_drivers (U2.13)
REL_B_CELL4: relays_1-4_DS4E (S_C4B.15), relay_drivers (U2.11)
SDI_DS: scanner_board_TOP (J8.5), relay_drivers (R18.1)
SDO_DS: scanner_board_TOP (J8.7), relay_drivers (R17.1)
STROBE: scanner_board_TOP (U5.10), relay_drivers (U1.7 U2.7)